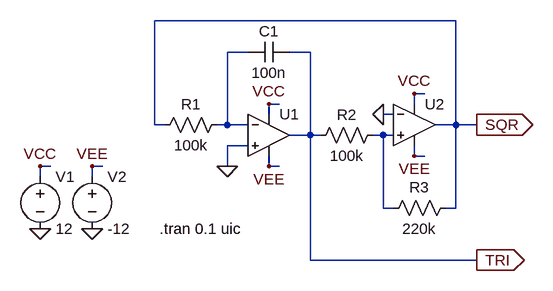
[diagram p0: schematic SimpleLFO_0.asc]
SimpleLFO_0.asc, the LTspice schematic file:
Version 4
SHEET 1 880 680
WIRE 672 128 208 128
WIRE 352 176 320 176
WIRE 448 176 416 176
WIRE 624 240 608 240
WIRE 400 256 384 256
WIRE 608 256 608 240
WIRE 384 272 384 256
WIRE 576 272 560 272
WIRE 208 288 208 128
WIRE 224 288 208 288
WIRE 320 288 320 176
WIRE 320 288 304 288
WIRE 352 288 320 288
WIRE 672 288 672 128
WIRE 672 288 640 288
WIRE 704 288 672 288
WIRE 448 304 448 176
WIRE 448 304 416 304
WIRE 464 304 448 304
WIRE 560 304 544 304
WIRE 576 304 560 304
WIRE 352 320 320 320
WIRE 608 336 608 320
WIRE 624 336 608 336
WIRE 48 352 32 352
WIRE 128 352 112 352
WIRE 320 352 320 320
WIRE 384 352 384 336
WIRE 400 352 384 352
WIRE 32 368 32 352
WIRE 112 368 112 352
WIRE 560 416 560 304
WIRE 576 416 560 416
WIRE 672 416 672 288
WIRE 672 416 656 416
WIRE 448 496 448 304
WIRE 704 496 448 496
FLAG 32 448 0
FLAG 112 448 0
FLAG 32 352 VCC
FLAG 112 352 VEE
FLAG 384 256 VCC
FLAG 384 352 VEE
FLAG 320 352 0
FLAG 608 240 VCC
FLAG 608 336 VEE
FLAG 704 288 SQR
IOPIN 704 288 Out
FLAG 704 496 TRI
IOPIN 704 496 Out
FLAG 560 272 0
SYMBOL voltage 32 352 R0
WINDOW 123 0 0 Left 0
WINDOW 39 0 0 Left 0
SYMATTR InstName V1
SYMATTR Value 12
SYMBOL voltage 112 352 R0
WINDOW 123 0 0 Left 0
WINDOW 39 0 0 Left 0
SYMATTR InstName V2
SYMATTR Value -12
SYMBOL Opamps\\UniversalOpamp2 384 304 R0
SYMATTR InstName U1
SYMBOL cap 416 160 R90
WINDOW 0 0 32 VBottom 2
WINDOW 3 32 32 VTop 2
SYMATTR InstName C1
SYMATTR Value 100n
SYMBOL res 320 272 R90
WINDOW 0 0 56 VBottom 2
WINDOW 3 32 56 VTop 2
SYMATTR InstName R1
SYMATTR Value 100k
SYMBOL res 560 288 R90
WINDOW 0 0 56 VBottom 2
WINDOW 3 32 56 VTop 2
SYMATTR InstName R2
SYMATTR Value 100k
SYMBOL Opamps\\UniversalOpamp2 608 288 R0
SYMATTR InstName U2
SYMBOL res 672 400 R90
WINDOW 0 0 56 VBottom 2
WINDOW 3 32 56 VTop 2
SYMATTR InstName R3
SYMATTR Value 220k
TEXT 216 448 Left 2 !.tran 0.1 uic

The netlist it stands for:
* SimpleLFO_0.asc
V1 VCC 0 12
V2 VEE 0 -12
XU1 0 N001 VCC VEE TRI level.2 Avol=1Meg GBW=10Meg Slew=10Meg ilimit=25m rail=0 Vos=0 phimargin=45 en=0 enk=0 in=0 ink=0 Rin=500Meg  ; pins IN+ IN- V+ V- OUT
C1 TRI N001 100n
R1 N001 SQR 100k
R2 N002 TRI 100k
XU2 N002 0 VCC VEE SQR level.2 Avol=1Meg GBW=10Meg Slew=10Meg ilimit=25m rail=0 Vos=0 phimargin=45 en=0 enk=0 in=0 ink=0 Rin=500Meg  ; pins IN+ IN- V+ V- OUT
R3 SQR N002 220k
.tran 0.1 uic
.lib UniversalOpamps2.sub
.backanno
.end